# Altium schematic sheet [05] - CPU CRITICAL SIGNALS.SchDoc: CPU CRITICAL SIGNALS
size A4; Organization: Bjørn T. Brodtkorb; Address1: Frode Rinnans veg 161; Address2: 7050 Trondheim; DocumentNumber: 6598; Revision: 1.0; SheetNumber: 1; SheetTotal: 1
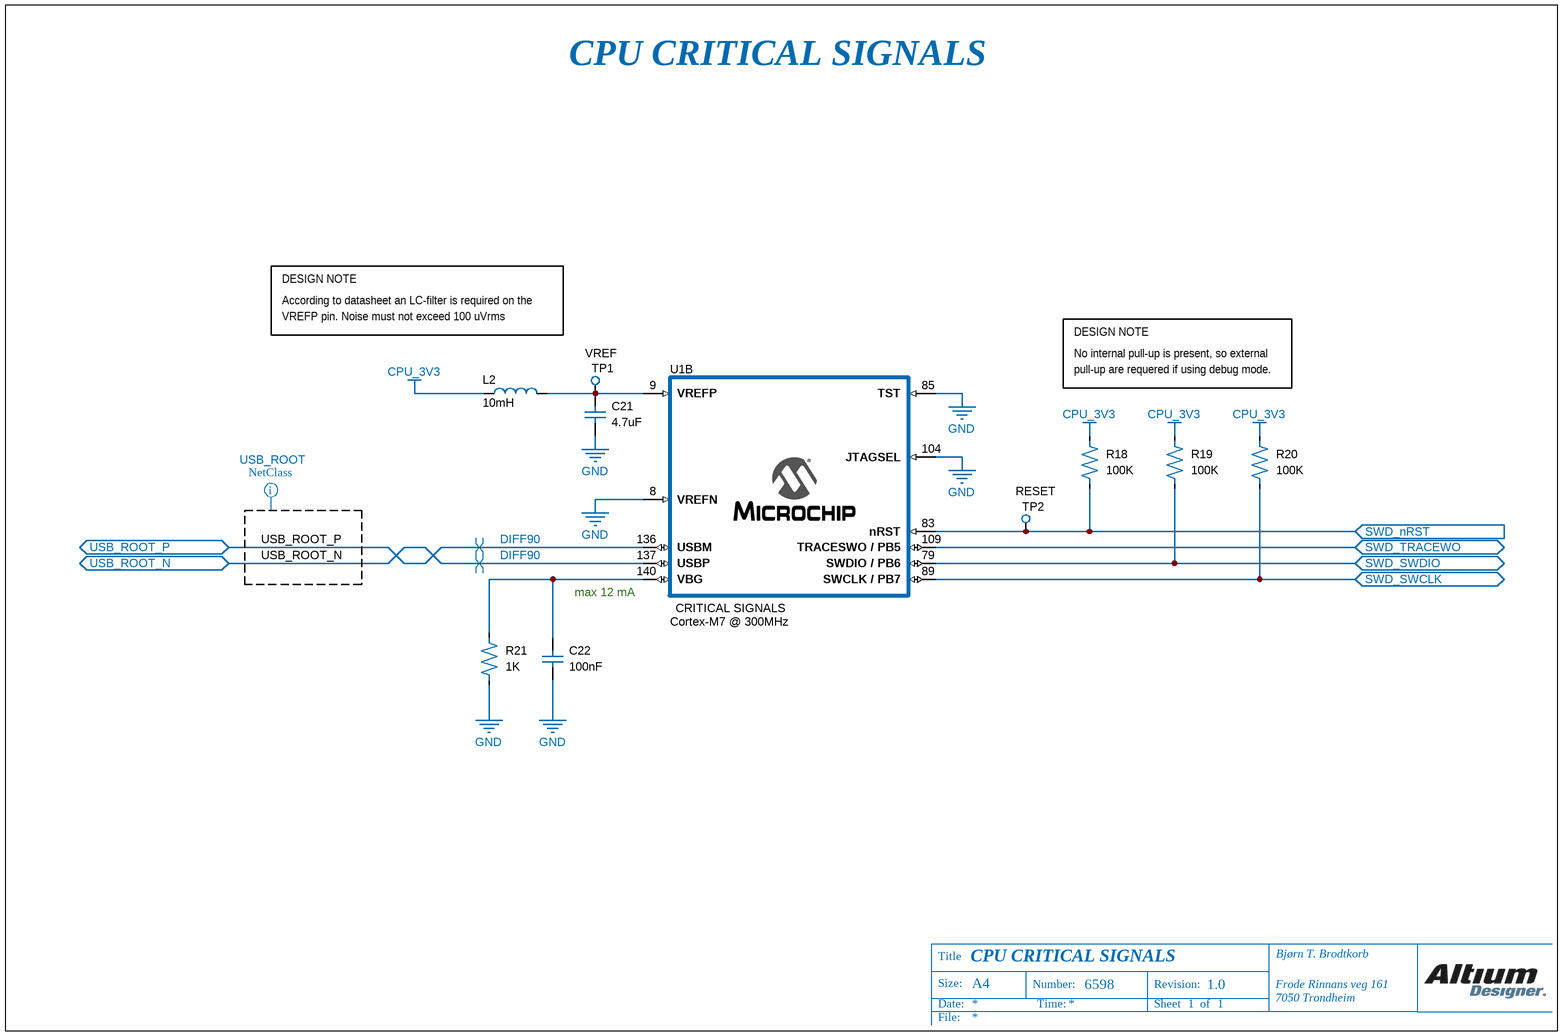
[diagram p0: [05] - CPU CRITICAL SIGNALS.SchDoc]

## Parts
C21  value 4.7uF  [C0603]  (hidden comment: 02016D104KAT2A)
C22  value 100nF  [C0402]  (hidden comment: 04023C103KAT2A)
L2  value 10mH  [Inductor 0603]  (hidden comment: MLZ1608A2R2WT)
R18  value 100K  [R0603]  (hidden comment: CPF-A-0603B100KE1)
R19  value 100K  [R0603]  (hidden comment: CPF-A-0603B100KE1)
R20  value 100K  [R0603]  (hidden comment: CPF-A-0603B100KE1)
R21  value 1K  [R0402]  (hidden comment: CRCW04020000Z0ED)
TP1  Type: VREF  [TEST POINT]  (hidden comment: Test point)
TP2  Type: RESET  [TEST POINT]  (hidden comment: Test point)
U1  Cortex-M7 @ 300MHz  [ATSAMS70Q21A-AN]  (part B of 3)

## Ports
SWD_nRST (in), SWD_SWCLK (bidir), SWD_SWDIO (bidir), SWD_TRACEWO (bidir), USB_ROOT_N (bidir), USB_ROOT_P (bidir)

## Nets
CPU_3V3: L2.1 R18.2 R19.2 R20.2
GND: C21.2 C22.1 R21.2 U1.8(VREFN) U1.85(TST) U1.104(JTAGSEL)
SWD_nRST: R18.1 TP2.1 U1.83(nRST) ; port SWD_nRST
SWD_SWCLK: R20.1 U1.89(SWCLK_/_PB7) ; port SWD_SWCLK
SWD_SWDIO: R19.1 U1.79(SWDIO_/_PB6) ; port SWD_SWDIO
SWD_TRACEWO: U1.109(TRACESWO_/_PB5) ; port SWD_TRACEWO
USB_ROOT_N: U1.137(USBP) ; port USB_ROOT_N
USB_ROOT_P: U1.136(USBM) ; port USB_ROOT_P
NetC21_1: C21.1 L2.2 TP1.1 U1.9(VREFP)
NetC22_2: C22.2 R21.1 U1.140(VBG)

## Layout directives
differential pair; differential pair class DIFF90: USB_ROOT_N, USB_ROOT_P
net class USB_ROOT: USB_ROOT_N, USB_ROOT_P

## Notes on the sheet
- CPU CRITICAL SIGNALS
- DESIGN NOTE
- According to datasheet an LC-filter is required on the
- VREFP pin. Noise must not exceed 100 uVrms
- No internal pull-up is present, so external
- pull-up are requered if using debug mode.
- max 12 mA
- Title
- Size:
- A4
- Number:
- Revision:
- Date:
- File:
- Time:
- Sheet
- of
- (in symbol ATSAMS70Q21A-AN, part B) CRITICAL SIGNALS

## Library data of the parts
C21 = 02016D104KAT2A: C0603
C22 = 04023C103KAT2A: C0402
L2 = MLZ1608A2R2WT: Inductor 0603
R18-R20 = CPF-A-0603B100KE1: R0603
R21 = CRCW04020000Z0ED: R0402
U1 = ATSAMS70Q21A-AN: ATSAMS70Q21; Supplier Part Number 1: 2484397; Supplier 1: Farnell